# EAGLE design fermentcontrol (EAGLE 7.1.0)
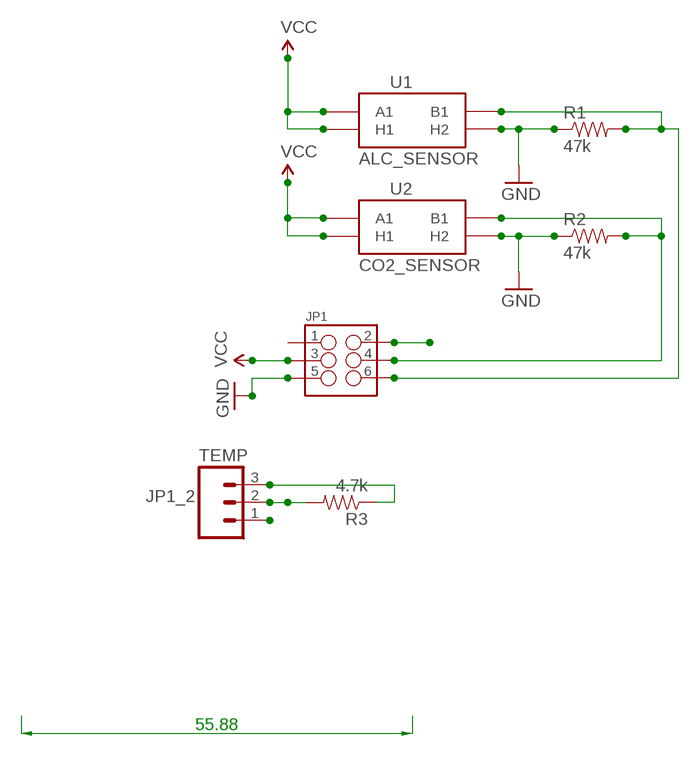
[diagram p0: schematic, sheet 1]

## Parts
JP1  M03X2SHROUD  [2X3-SHROUDED]
R1  47k  RESISTORPTH-1/4W  [AXIAL-0.4]
R2  47k  RESISTORPTH-1/4W  [AXIAL-0.4]
R3  4.7k  RESISTORPTH-1/4W  [AXIAL-0.4]
TEMP  M03POLAR  [MOLEX-1X3]
U1  ALC_SENSOR  GAS_SENSOR  [MQ-3]
U2  CO2_SENSOR  GAS_SENSOR  [MQ-3]

## Nets
D01: JP1.2 R3.P$2 TEMP.2
GND: JP1.5 R1.P$1 R2.P$1 TEMP.1 U1.HB(H2) U2.HB(H2)
N$2: JP1.6 R1.P$2 U1.B1
N$7: JP1.4 R2.P$2 U2.B1
VCC: JP1.3 R3.P$1 TEMP.3 U1.A1 U1.HA(H1) U2.A1 U2.HA(H1)
Unconnected: JP1.1

## Notes on the sheet
- JP1_2

## Library data of the parts
JP1 = SparkFun-Connectors:M03X2: 2x3 .1" header. Shrouded, with keying- CONN-10681 SMT- CONN-11415 Pogo pins- HW-11044; PROD_ID: CONN-10681
R1-R3 = SparkFun-Resistors:RESISTOR: Resistor Basic schematic elements and footprints for 0603, 1206, and PTH resistors.
TEMP = SparkFun-Connectors:M03: Header 3 Standard 3-pin 0.1" header. Use with straight break away headers (SKU : PRT-00116), right angle break away headers (PRT-00553), swiss pins (PRT-00743), machine pins (PRT-00117), and female headers (PRT-00115). Molex polarized connector foot print use with SKU : PRT-08232 with associated crimp pins and housings.
U1 U2 = SparkFun-Sensors:GAS_SENSOR: MQ-3 alcohol gas sensor . FP not tested. SEN-08880.

## Board
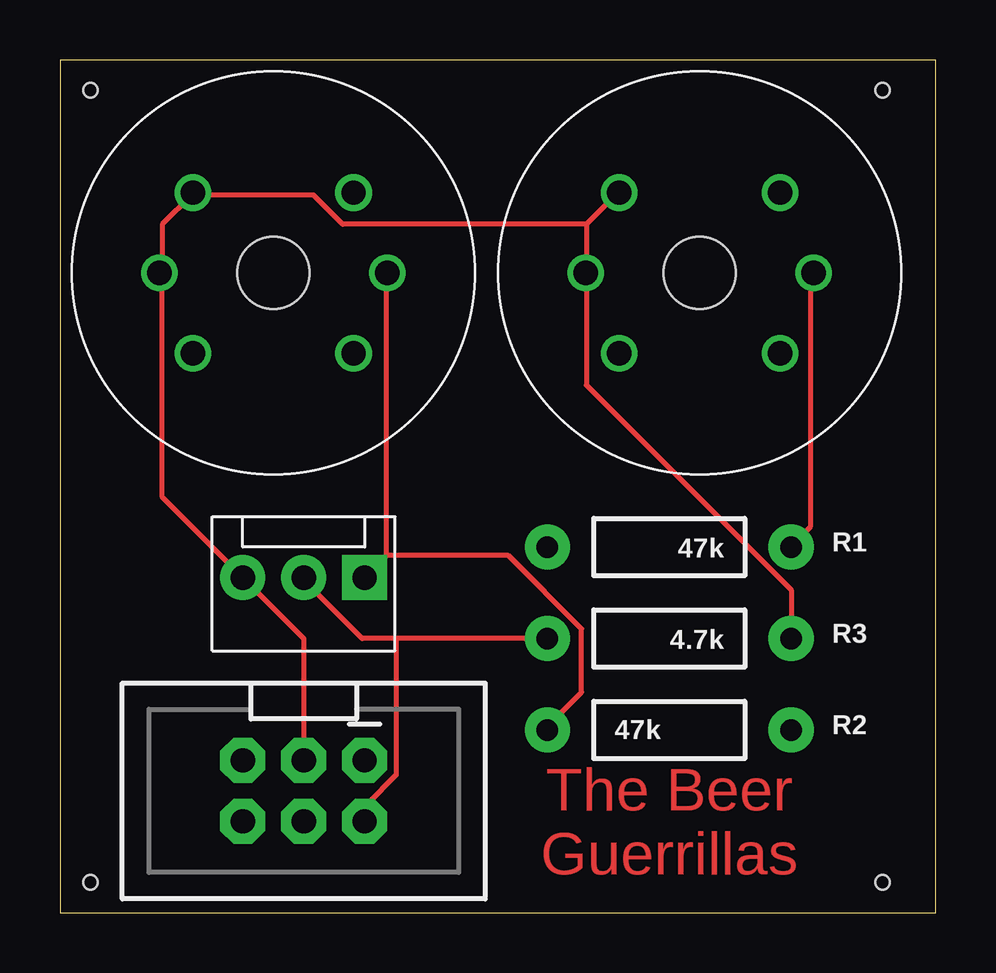
[diagram p1: board, top side]
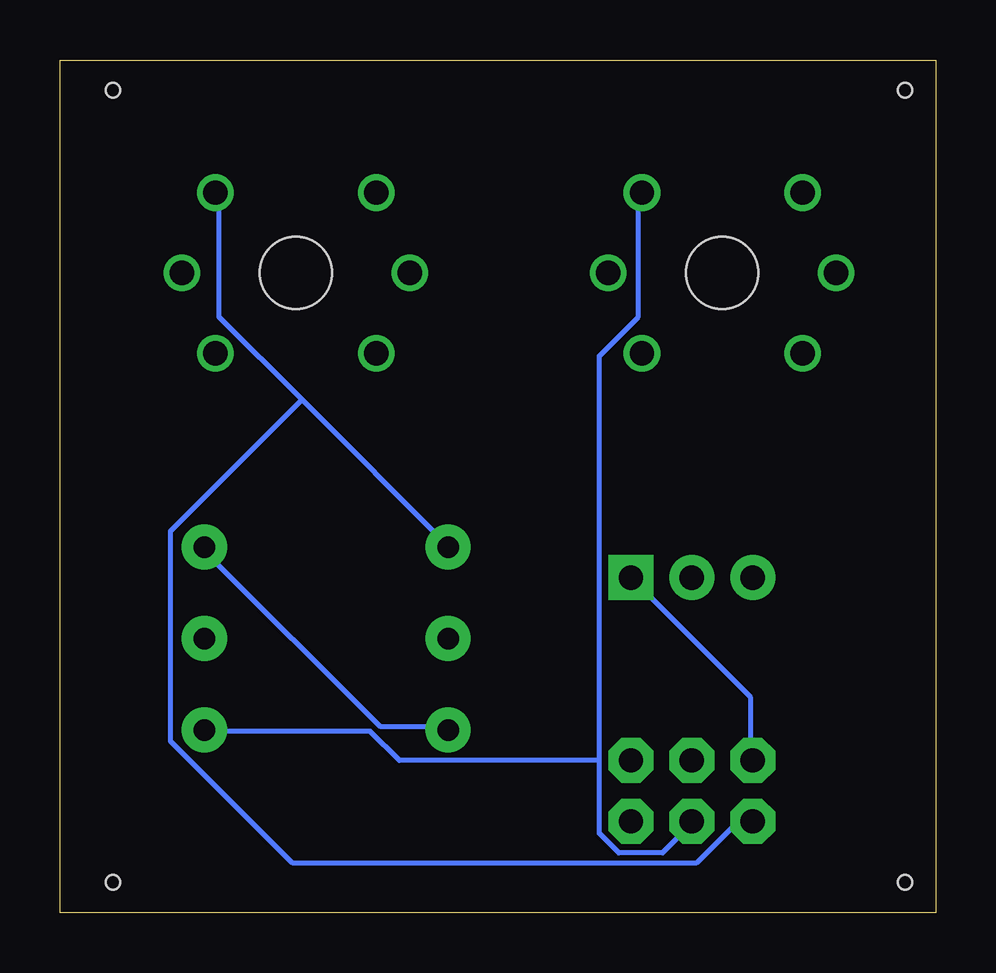
[diagram p2: board, bottom side, seen from below]

Size 36.5 x 35.55 mm. Coordinates in mm from the lower left corner, seen from the top.
Outline: 0,0 36.5,0 36.5,35.55 0,35.55 0,0
Copper layers (1*16): Top 0.0356mm / dielectric 1.5011mm / Bottom 0.0356mm
Design rules "LaenPCBOrder": minimum track width 6mil, minimum drill 13mil, track to track 6mil, track to pad 6mil, pad to pad 6mil, via to via 6mil, smd to smd 6mil, copper to edge 15mil, drill to drill 6mil, minimum pad ring 7mil, minimum via ring 7mil, stop-mask expansion 3mil, vias tented up to drill 0mil, thermal gap 10mil
Holes 0.6 mm at 1.27,34.29 34.29,34.29 1.27,1.27 34.29,1.27

### Footprints (pad centres in the part's own frame; a part is rotated, then mirrored left to right if it is on the bottom)
2X3-SHROUDED = drill 1.016 pad 1.88 octagon: 1 -1.27,2.54; 2 1.27,2.54; 3 -1.27,0; 4 1.27,0; 5 -1.27,-2.54; 6 1.27,-2.54
AXIAL-0.4 = drill 0.9 pad 1.88: P$1 -5.08,0; P$2 5.08,0
MOLEX-1X3 = drill 1.016 pad 1.88 square: 1 0,0 | drill 1.016 pad 1.88: 2 2.54,0; 3 5.08,0
MQ-3 = drill 1.016: A1 -3.35,3.35; A2 -3.35,-3.35; B1 3.35,3.35; B2 3.35,-3.35; HA -4.75,0; HB 4.75,0 | hole 3: 0,0

### Placement (x,y rotation side)
JP1  10.16,5.08 270 top
R1  25.4,15.24 180 top
R2  25.4,7.62 0 top
R3  25.4,11.43 180 top
TEMP  12.7,13.97 180 top
U1  26.67,26.67 0 top
U2  8.89,26.67 0 top

### Tracks (layer width: path | path; a pad name or v marks a point on that pad's centre or on a via)
D01
  Top 0.203: R3.P$2 14.02,11.43 | 14.02,11.43 12.6,11.43 10.16,13.87 TEMP.2 | 14.02,11.43 14.02,5.74 12.8,4.52 12.8,3.91 JP1.2
GND
  Top 0.203: U1.HB 31.29,26.67 31.29,16.1 30.48,15.29 R1.P$1 | 13.61,14.88 13.61,26.67 U2.HB | 13.61,14.88 TEMP.1 12.8,14.07 | 13.61,14.88 18.69,14.88 21.74,11.84 21.74,9.2 20.32,7.77 R2.P$1
  Bottom 0.203: R2.P$1 20.32,7.77 23.16,7.77 30.48,15.09 R1.P$1 | TEMP.1 7.72,8.99 7.72,6.35 JP1.5
N$2
  Bottom 0.203: 26.42,21.39 20.32,15.29 R1.P$2 | 26.42,21.39 29.87,24.84 29.87,29.92 U1.B1 | 26.42,21.39 31.9,15.9 31.9,7.16 26.82,2.08 9.96,2.08 8.33,3.71 7.72,3.71 JP1.6
N$7
  Bottom 0.203: 14.02,6.35 14.02,3.3 13.21,2.49 11.38,2.49 10.16,3.71 JP1.4 | 14.02,6.35 14.02,23.22 12.39,24.84 12.39,29.92 U2.B1 | 14.02,6.35 22.35,6.35 23.57,7.57 30.48,7.57 R2.P$2
VCC
  Top 0.203: 21.95,28.7 21.95,26.67 | 21.95,28.7 23.16,29.92 U1.A1 | R3.P$1 30.48,13.46 21.95,22 21.95,26.67 | 21.95,26.67 U1.HA | 21.95,28.7 11.79,28.7 10.57,29.92 5.69,29.92 U2.A1 5.49,29.92 4.27,28.7 4.27,26.67 | 4.27,26.67 4.27,17.32 TEMP.3 10.16,11.43 JP1.3 | 4.27,26.67 U2.HA

### Text on the board
Top: The Beer / Guerrillas